# Altium schematic sheet W806.SchDoc
size A4
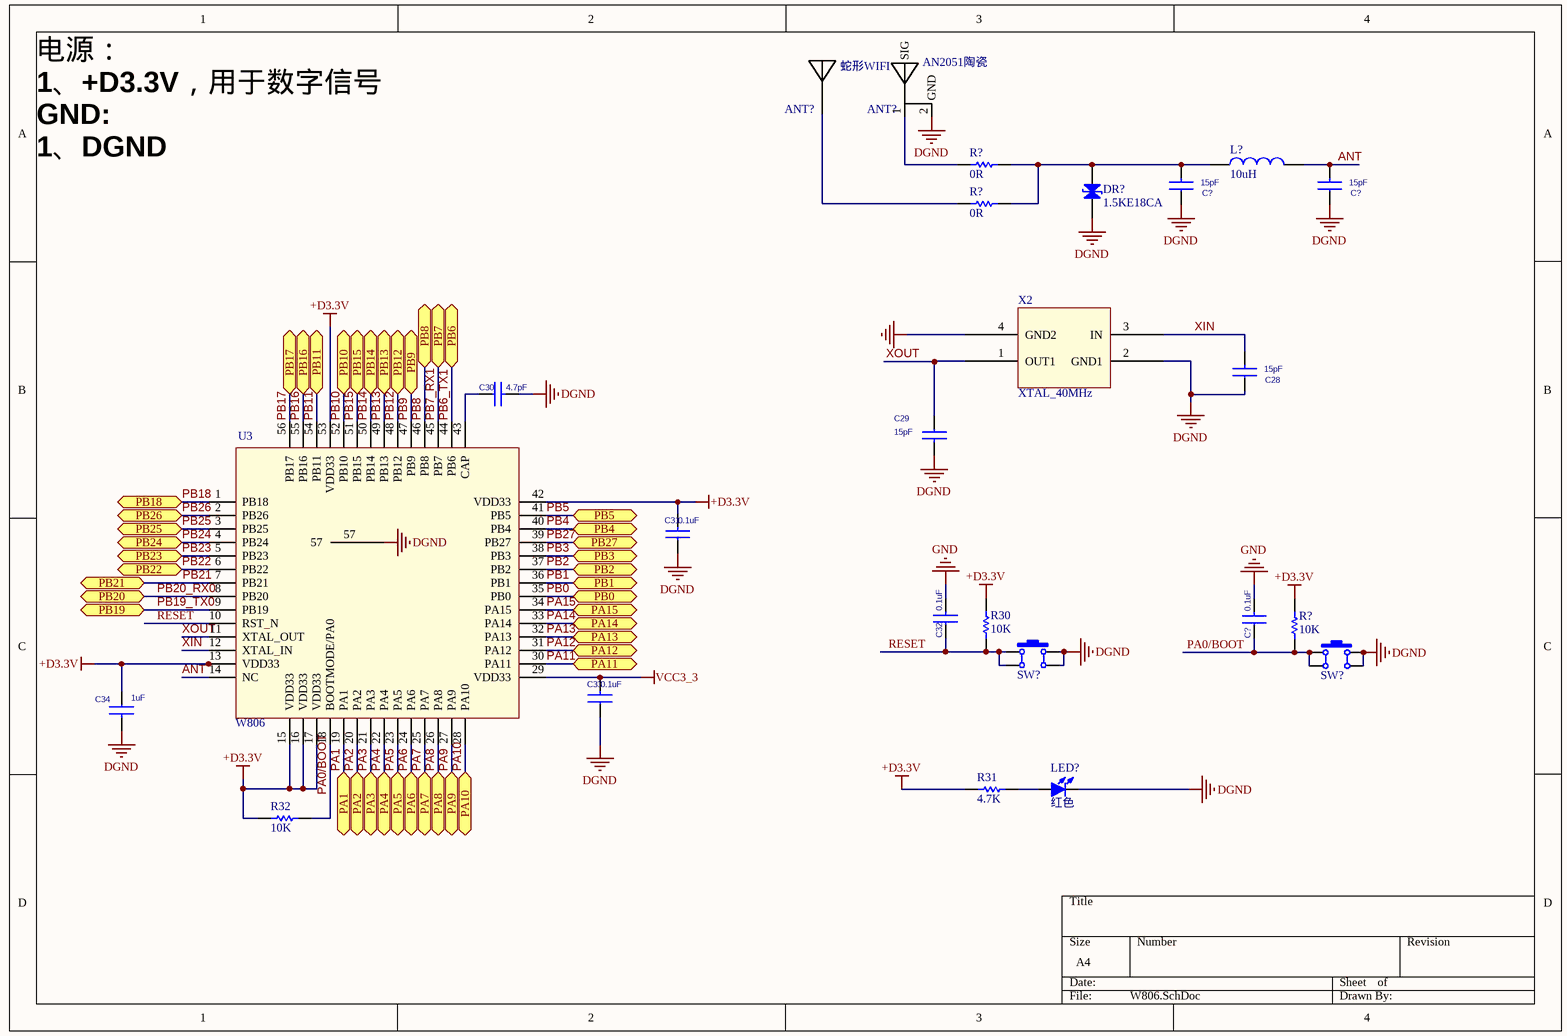
[diagram p0: W806.SchDoc]

## Parts
(Parts that share a designator on the sheet are numbered #1, #2 ... from top to bottom, then left to right.)
ANT?#1  蛇形WIFI  [WIFI-ANT]
ANT?#2  AN2051陶瓷  [ANT]
C28  15pF  [0603]
C29  15pF  [0603]
C30  4.7pF  [0603]
C31  0.1uF  [0603]
C32  0.1uF  [0603]
C33  0.1uF  [0603]
C34  1uF  [0603]
C?#1  15pF  [0603]
C?#2  15pF  [0603]
C?#3  0.1uF  [0603]
DR?  1.5KE18CA  [DO-15]
L?  10uH  [L0603]
LED?  红色  [LED0603_B]
R30  10K  [0603_1]
R31  4.7K  [0603_1]
R32  10K  [0603_1]
R?#1  0R  [0603_1]
R?#2  0R  [0603_1]
R?#3  10K  [0603_1]
SW?#1  4x4x1.5  [SW SMD-4*4*1.5]  (value not drawn)
SW?#2  4x4x1.5  [SW SMD-4*4*1.5]  (value not drawn)
U3  W806  [QFN56 6X6]
X2  XTAL_40MHz  [SMD-3225]

## Ports
PA1 (bidir), PA2 (bidir), PA3 (bidir), PA4 (bidir), PA5 (bidir), PA6 (bidir), PA7 (bidir), PA8 (bidir), PA9 (bidir), PA10 (bidir), PA11 (bidir), PA12 (bidir), PA13 (bidir), PA14 (bidir), PA15 (bidir), PB0 (bidir), PB1 (bidir), PB2 (bidir), PB3 (bidir), PB4 (bidir), PB5 (bidir), PB6 (bidir), PB7 (bidir), PB8 (bidir), PB9 (bidir), PB10 (bidir), PB11 (bidir), PB12 (bidir), PB13 (bidir), PB14 (bidir), PB15 (bidir), PB16 (bidir), PB17 (bidir), PB18 (bidir), PB19 (bidir), PB20 (bidir), PB21 (bidir), PB22 (bidir), PB23 (bidir), PB24 (bidir), PB25 (bidir), PB26 (bidir), PB27 (bidir)

## Nets
+D3.3V: C31.2 C34.1 R30.2 R31.1 R32.2 R?#3.2 U3.13(VDD33) U3.15(VDD33) U3.16(VDD33) U3.17(VDD33) U3.42(VDD33) U3.53(VDD33)
DGND: ANT?#2.2(GND) C28.1 C29.2 C30.2 C31.1 C33.1 C34.2 C?#1.1 C?#2.1 DR?.2(K) LED?.2(K) SW?#1.2 SW?#1.3 SW?#2.2 SW?#2.3 U3.57 X2.2(GND1)
GND: C32.2 C?#3.2 X2.4(GND2)
VCC3_3: C33.2 U3.29(VDD33)
ANT: C?#2.2 L?.2 U3.14(NC)
PA0/BOOT: C?#3.1 R32.1 R?#3.1 SW?#2.1 SW?#2.4 U3.18(BOOTMODE/PA0)
PA1: U3.19(PA1) ; port PA1
PA2: U3.20(PA2) ; port PA2
PA3: U3.21(PA3) ; port PA3
PA4: U3.22(PA4) ; port PA4
PA5: U3.23(PA5) ; port PA5
PA6: U3.24(PA6) ; port PA6
PA7: U3.25(PA7) ; port PA7
PA8: U3.26(PA8) ; port PA8
PA9: U3.27(PA9) ; port PA9
PA10: U3.28(PA10) ; port PA10
PA11: U3.30(PA11) ; port PA11
PA12: U3.31(PA12) ; port PA12
PA13: U3.32(PA13) ; port PA13
PA14: U3.33(PA14) ; port PA14
PA15: U3.34(PA15) ; port PA15
PB0: U3.35(PB0) ; port PB0
PB1: U3.36(PB1) ; port PB1
PB2: U3.37(PB2) ; port PB2
PB3: U3.38(PB3) ; port PB3
PB4: U3.40(PB4) ; port PB4
PB5: U3.41(PB5) ; port PB5
PB6_TX1: U3.44(PB6) ; port PB6
PB7_RX1: U3.45(PB7) ; port PB7
PB8: U3.46(PB8) ; port PB8
PB9: U3.47(PB9) ; port PB9
PB10: U3.52(PB10) ; port PB10
PB11: U3.54(PB11) ; port PB11
PB12: U3.48(PB12) ; port PB12
PB13: U3.49(PB13) ; port PB13
PB14: U3.50(PB14) ; port PB14
PB15: U3.51(PB15) ; port PB15
PB16: U3.55(PB16) ; port PB16
PB17: U3.56(PB17) ; port PB17
PB18: U3.1(PB18) ; port PB18
PB19_TX0: U3.9(PB19) ; port PB19
PB20_RX0: U3.8(PB20) ; port PB20
PB21: U3.7(PB21) ; port PB21
PB22: U3.6(PB22) ; port PB22
PB23: U3.5(PB23) ; port PB23
PB24: U3.4(PB24) ; port PB24
PB25: U3.3(PB25) ; port PB25
PB26: U3.2(PB26) ; port PB26
PB27: U3.39(PB27) ; port PB27
RESET: C32.1 R30.1 SW?#1.1 SW?#1.4 U3.10(RST_N)
XIN: C28.2 U3.12(XTAL_IN) X2.3(IN)
XOUT: C29.1 U3.11(XTAL_OUT) X2.1(OUT1)
NetANT?#1_1: ANT?#1.1 R?#2.2
NetANT?#2_1: ANT?#2.1(SIG) R?#1.2
NetC30_1: C30.1 U3.43(CAP)
NetC?#1_2: C?#1.2 DR?.1(A) L?.1 R?#1.1 R?#2.1
NetLED?_1: LED?.1(A) R31.2

## Notes on the sheet
- 电源：
  1、+D3.3V，用于数字信号
  GND:
  1、DGND

## Library data of the parts
ANT?#1 = ANT_1PIN: PCB板载天线，单引脚; 联系卖家，免费技术支持: 唯一出售店铺网址https://shop463601444.taobao.com; BOM名称: PCB板载天线
ANT?#2 = ANT_2PIN: PCB板载天线，带地线引脚; 联系卖家，免费技术支持: 唯一出售店铺网址https://shop463601444.taobao.com; BOM名称: PCB板载天线
C28-C34 C?#1-C?#3 = CAP NP_Dup1
DR? = DR: 瞬态电压抑制二极管; 以赠品形式获赠本封装库的买家，还可联系卖家免费指导AD软件使用: 封装库来自淘宝卖家ID：黄晶宝石; 联系卖家 免费查找封装: 唯一出售店铺网址https://shop463601444.taobao.com; BOM名称: 瞬态电压抑制二极管
L? = L: 贴片小功率电感; BOM名称: 小功率贴片电感; 联系卖家，免费查找封装: 唯一出售店铺网址https://shop463601444.taobao.com
LED? = LED-SMD: 贴片LED; 封装库来自淘宝卖家ID：黄晶宝石: 其他店铺购入均为盗版封装库，请立即申请退款，本店现金奖励20~200元; BOM名称: 贴片LED
R30-R32 R?#1-R?#3 = Res1: Resistor; Published: 8-Jun-2000; LatestRevisionDate: 17-Jul-2002; LatestRevisionNote: Re-released for DXP Platform.; PackageReference: AXIAL-0.3; Publisher: Altium Limited
  R30 R32 R?#3: Value: 10K
  R31: Value: 4.7K
  R?#1 R?#2: Value: 0R
SW?#1 SW?#2 = SW SMD-4x4: 贴片4x4轻触开关; 联系卖家，免费查找封装: 唯一出售店铺网址https://shop463601444.taobao.com; 封装库来自淘宝卖家ID:黄晶宝石: 其他店铺购入均为盗版假冒封装库，请立即申请退款，本店现金奖励20~200元; BOM名称: 贴片4x4轻触开关
U3 = W806: 平头哥W806芯片，主频240MHz